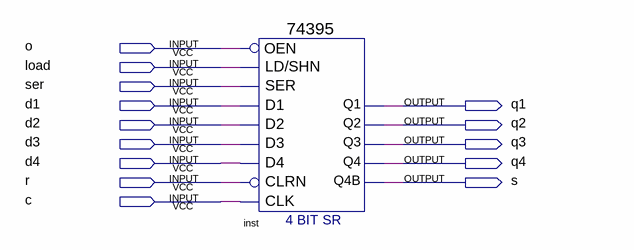
[diagram p0: schematic sheet]
// Quartus schematic point6.bdf as structural Verilog: 1 symbols, 14 pins
module point6 (
  input  o,
  input  load,
  input  ser,
  input  d1,
  input  d2,
  input  d3,
  input  d4,
  input  r,
  input  c,
  output q1,
  output q2,
  output q3,
  output q4,
  output s
);

  \74395  inst (
    .\LD/SHN (load), .SER(ser), .D1(d1), .D2(d2), .D3(d3), .CLRN(r), .CLK(c), .D4(d4), .OEN(o), .Q4(q4),
    .Q4B(s), .Q1(q1), .Q2(q2), .Q3(q3));
endmodule
